# EAGLE schematic BluePLC B1 MEGA128 -00 (EAGLE 5.03)

## Sheet 1 of 4
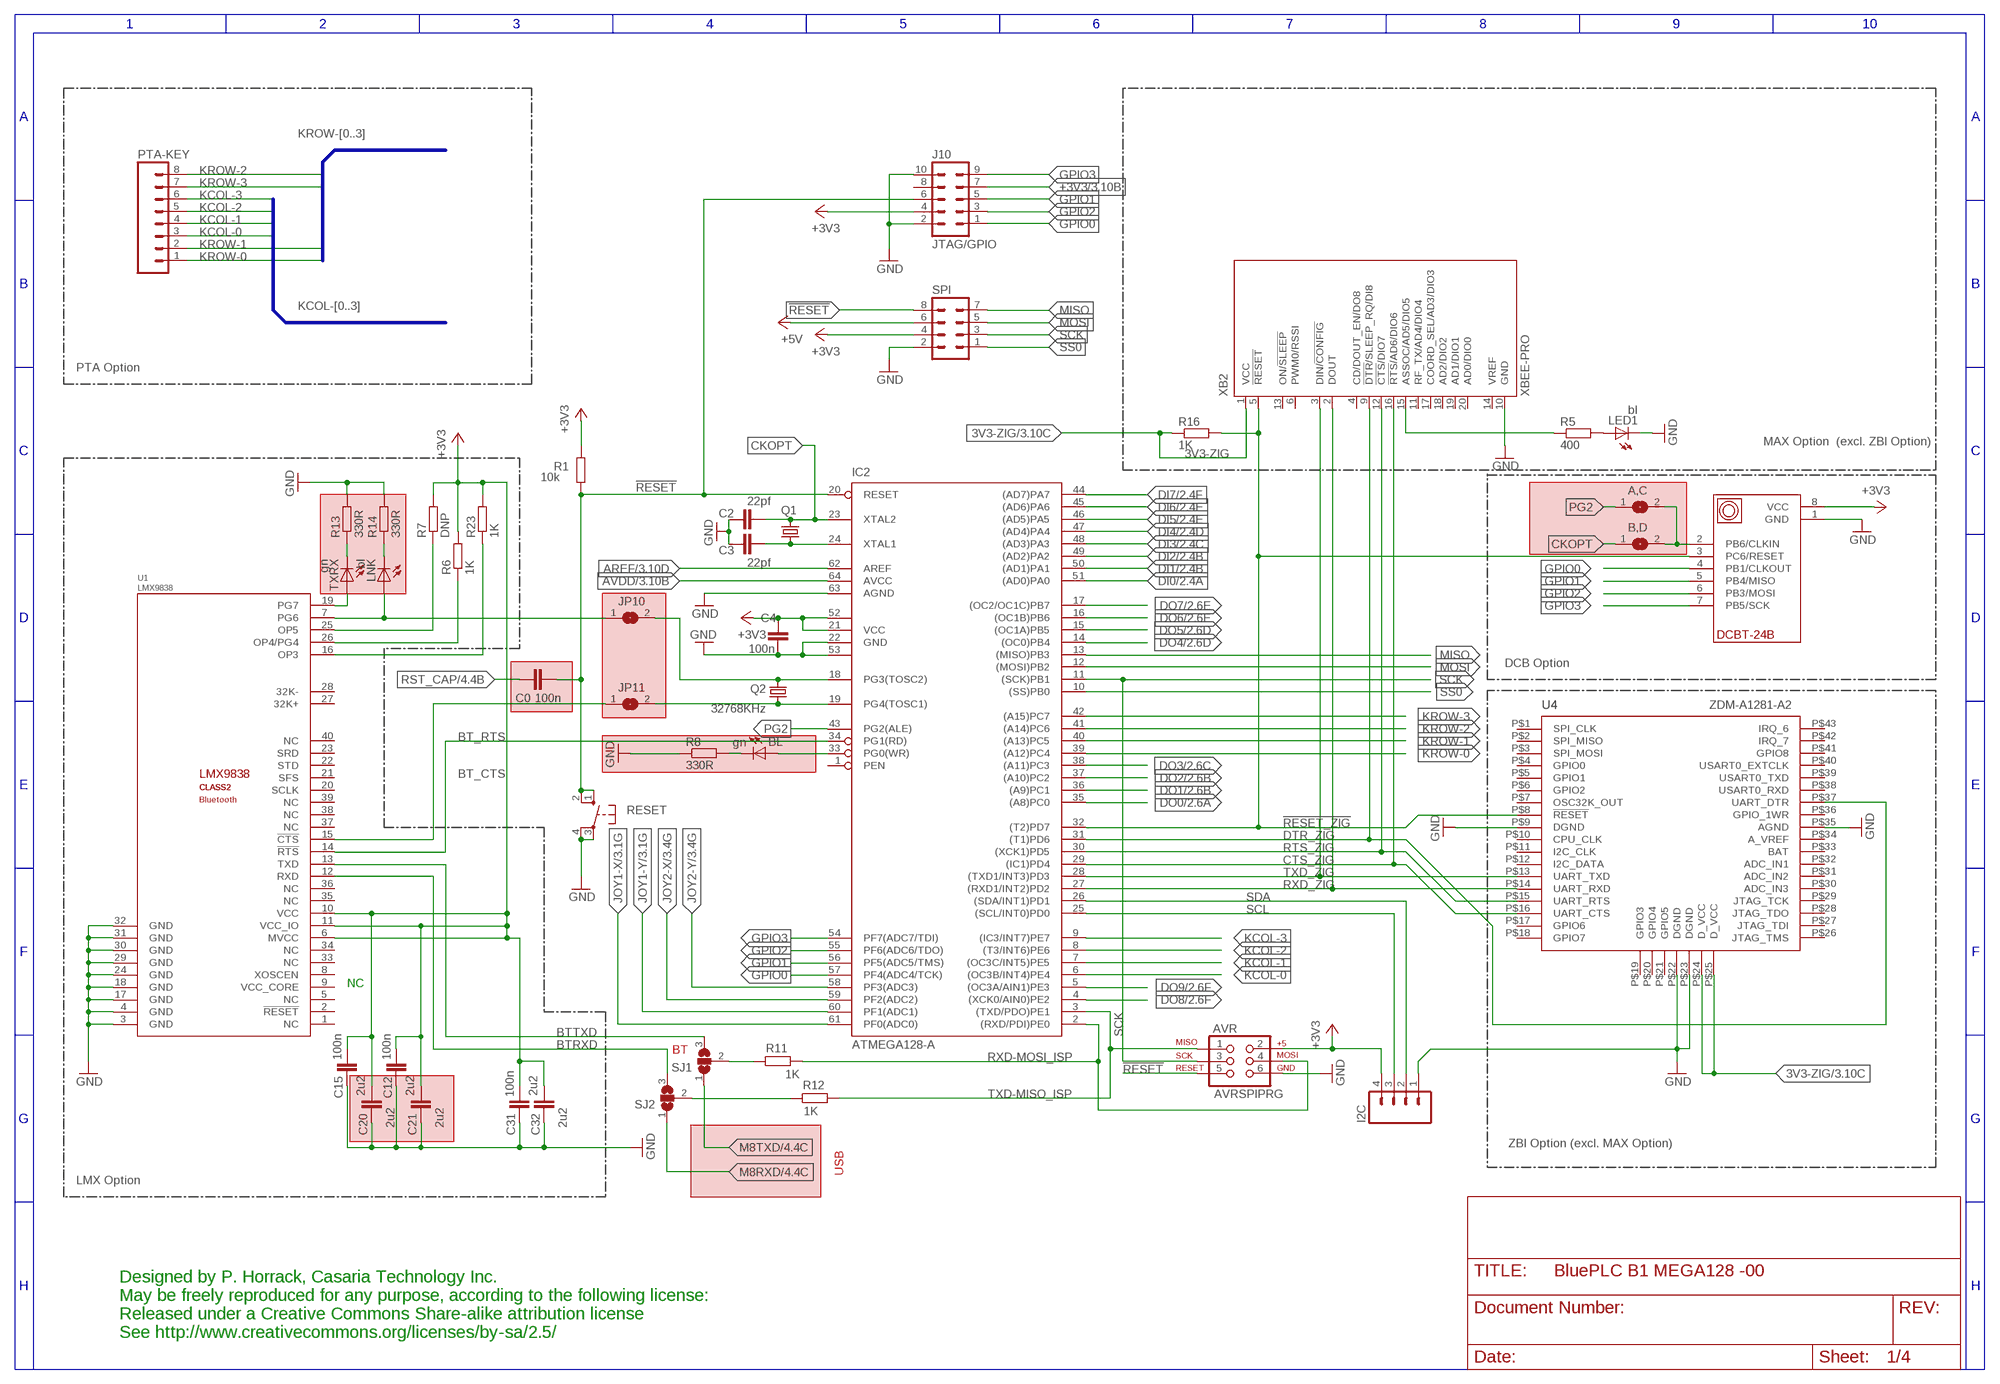
[diagram p0: schematic, sheet 1]

### Parts
A,C  SJ  [SJ]
AVR  AVRSPIPRG  AVR_SPI_PRG_6PTH  [2X3]
B,D  SJ  [SJ]
BL  gn  LEDCHIP-LED0603  [CHIP-LED0603]
C0  100n  C-EUC1206  [C1206]
C2  22pf  C-EUC0805  [C0805]
C3  22pf  C-EUC0805  [C0805]
C4  100n  C-EUC1206  [C1206]
C12  100n  C-EUC0805  [C0805]
C15  100n  C-EUC0805  [C0805]
C20  2u2  C-EUC0805  [C0805]
C21  2u2  C-EUC0805  [C0805]
C31  100n  C-EUC0805  [C0805]
C32  2u2  C-EUC1210  [C1210]
I2C  M04  [04P]
IC2  ATMEGA128-A  MEGA128-A  [TQFP64]
J10  JTAG/GPIO  MA05-2  [MA05-2]
JP10  SJ  [SJ]
JP11  SJ  [SJ]
LED1  bl  LEDCHIP-LED0603  [CHIP-LED0603]
LNK  bl  LEDCHIP-LED0603  [CHIP-LED0603]
PTA-KEY  M08  [08P]
Q1  16Mhz  CRYSTALHC49U-V  [HC49U-V]
Q2  32768KHz  CRYSTALTC38H  [TC38H]
R1  10k  R-EU_R1206  [R1206]
R5  400  R-EU_M0805  [M0805]
R6  1K  R-EU_R0805  [R0805]
R7  DNP  R-EU_R0805  [R0805]
R8  330R  R-EU_R0805  [R0805]
R11  1K  R-EU_R1206  [R1206]
R12  1K  R-EU_R1206  [R1206]
R13  330R  R-EU_R0805  [R0805]
R14  330R  R-EU_R0805  [R0805]
R16  1K  R-EU_R0805  [R0805]
R23  1K  R-EU_R0805  [R0805]
RESET  10-XX  [B3F-10XX]
SJ1  SJ2W  [SJ_2]
SJ2  SJ2W  [SJ_2]
SPI  MA04-2  [MA04-2]
TXRX  gn  LEDCHIP-LED0603  [CHIP-LED0603]
U1  LMX9838  [LMX9838]
U2  dcbt-24b  DCBT-24BDCBT-24ABCD-MILLMAX0295_SOCKET  [DCB-24B-MILLMAX0295]
U4  ZDM-A1281-A2  [ZDM-A2]
XB2  XBEE-PRO  [XBEE-PRO]

### Nets
3V3-ZIG: R16.1 U4.P$24(D_VCC) U4.P$25(D_VCC) XB2.1(VCC) ; also sheet 3
!RESET: AVR.5 C0.2 IC2.20(RESET) J10.6 R1.1 RESET.1(S) RESET.2(S1) SPI.8
!RESET_ZIG: IC2.32((T2)PD7) R16.2 U2.3(PC6/RESET) U4.P$8(!RESET) XB2.5(!RESET)
+3V3 [power]: AVR.2 C4.1 C12.1 C15.1 C20.1 C21.1 C31.1 C32.1 I2C.4 IC2.21(VCC) IC2.52(VCC1) J10.4 J10.7 R1.2 R6.2 R7.2 R23.2 SPI.4 U1.6(MVCC) U1.10(VCC) U1.11(VCC_IO) U2.8(VCC) ; also sheet 3,4
+5V [power]: SPI.6 ; also sheet 3
AREF [smps]: IC2.62(AREF) ; also sheet 3
AVDD: IC2.64(AVCC) ; also sheet 3
BT_CTS: JP11.1 U1.15(!CTS)
BT_RTS: IC2.34(PG1(RD)) U1.14(!RTS)
BTRXD [power]: SJ2.3 U1.12(RXD)
BTTXD [power]: SJ1.3 U1.13(TXD)
CKOPT: B,D.1 C2.2 IC2.23(XTAL2) Q1.2
CTS_ZIG: IC2.29((IC1)PD4) U4.P$16(UART_CTS) XB2.16(!RTS!/AD6/DIO6)
DI0: IC2.51((AD0)PA0) ; also sheet 2
DI1: IC2.50((AD1)PA1) ; also sheet 2
DI2: IC2.49((AD2)PA2) ; also sheet 2
DI3: IC2.48((AD3)PA3) ; also sheet 2
DI4: IC2.47((AD4)PA4) ; also sheet 2
DI5: IC2.46((AD5)PA5) ; also sheet 2
DI6: IC2.45((AD6)PA6) ; also sheet 2
DI7: IC2.44((AD7)PA7) ; also sheet 2
DO0: IC2.35((A8)PC0) ; also sheet 2
DO1: IC2.36((A9)PC1) ; also sheet 2
DO2: IC2.37((A10)PC2) ; also sheet 2
DO3: IC2.38((A11)PC3) ; also sheet 2
DO4: IC2.14((OC0)PB4) ; also sheet 2
DO5: IC2.15((OC1A)PB5) ; also sheet 2
DO6: IC2.16((OC1B)PB6) ; also sheet 2
DO7: IC2.17((OC2/OC1C)PB7) ; also sheet 2
DO8: IC2.4((XCK0/AIN0)PE2) ; also sheet 2
DO9: IC2.5((OC3A/AIN1)PE3) ; also sheet 2
DTR_ZIG: IC2.31((T1)PD6) U4.P$37(UART_DTR) XB2.9(!DTR!/SLEEP_RQ/DI8)
GND [gnd]: AVR.6 C2.1 C3.1 C4.2 C12.2 C15.2 C20.2 C21.2 C31.2 C32.2 I2C.1 IC2.22(GND) IC2.53(GND1) IC2.63(AGND) J10.2 J10.10 LED1.C R8.1 R13.2 R14.2 RESET.3(P) RESET.4(P1) SPI.2 U1.3(GND) U1.4(GND) U1.17(GND) U1.18(GND) U1.24(GND) U1.29(GND) U1.30(GND) U1.31(GND) U1.32(GND) U2.1(GND) U4.P$9(DGND) U4.P$22(DGND) U4.P$23(DGND) U4.P$35(AGND) XB2.10(GND) ; also sheet 2,3,4
GPIO0: IC2.57(PF4(ADC4/TCK)) J10.1 U2.4(PB1/CLKOUT)
GPIO1: IC2.56(PF5(ADC5/TMS)) J10.5 U2.5(PB4/MISO)
GPIO2: IC2.55(PF6(ADC6/TDO)) J10.3 U2.6(PB3/MOSI)
GPIO3: IC2.54(PF7(ADC7/TDI)) J10.9 U2.7(PB5/SCK)
JOY1-X: IC2.61(PF0(ADC0)) ; also sheet 3
JOY1-Y: IC2.60(PF1(ADC1)) ; also sheet 3
JOY2-X: IC2.59(PF2(ADC2)) ; also sheet 3
JOY2-Y: IC2.58(PF3(ADC3)) ; also sheet 3
KCOL-0: IC2.6((OC3B/INT4)PE4) PTA-KEY.3
KCOL-1: IC2.7((OC3C/INT5)PE5) PTA-KEY.4
KCOL-2: IC2.8((T3/INT6)PE6) PTA-KEY.5
KCOL-3: IC2.9((IC3/INT7)PE7) PTA-KEY.6
KROW-0: IC2.39((A12)PC4) PTA-KEY.1
KROW-1: IC2.40((A13)PC5) PTA-KEY.2
KROW-2: IC2.41((A14)PC6) PTA-KEY.8
KROW-3: IC2.42((A15)PC7) PTA-KEY.7
M8RXD: SJ2.1 ; also sheet 4
M8TXD: SJ1.1 ; also sheet 4
MISO: IC2.13((MISO)PB3) SPI.7
MOSI: IC2.12((MOSI)PB2) SPI.5
N$6: R11.1 SJ1.2
N$10: R13.1 TXRX.C
N$11: R6.1 U1.26(OP4/PG4)
N$23: LED1.A R5.2
N$24: R5.1 XB2.15(ASSOC/AD5/DIO5)
N$31: C3.2 IC2.24(XTAL1) Q1.1
N$37: R7.1 U1.25(OP5)
N$38: LNK.C R14.1
N$39: BL.C R8.2
N$61: BL.A IC2.33(PG0(WR))
N$64: TXRX.A U1.19(PG7)
N$66: A,C.2 B,D.2 U2.2(PB6/CLKIN)
N$67: R12.1 SJ2.2
N$74: R23.1 U1.16(OP3)
N$94: IC2.18(PG3(TOSC2)) JP10.2 Q2.2
N$95: IC2.19(PG4(TOSC1)) JP11.2 Q2.1
PG2: A,C.1 IC2.43(PG2(ALE))
RST_CAP: C0.1 ; also sheet 4
RTS_ZIG: IC2.30((XCK1)PD5) U4.P$15(UART_RTS) XB2.12(!CTS!/DIO7)
RXD-MOSI_ISP: AVR.4 IC2.2((RXD/PDI)PE0) R11.2
RXD_ZIG: IC2.27((RXD1/INT2)PD2) U4.P$14(UART_RXD) XB2.2(DOUT)
SCK: AVR.3 IC2.11((SCK)PB1) SPI.3
SCL: I2C.3 IC2.25((SCL/INT0)PD0)
SDA: I2C.2 IC2.26((SDA/INT1)PD1)
SS0: IC2.10((SS)PB0) SPI.1
TX/RX: JP10.1 LNK.A U1.7(PG6)
TXD-MISO_ISP: AVR.1 IC2.3((TXD/PDO)PE1) R12.2
TXD_ZIG: IC2.28((TXD1/INT3)PD3) U4.P$13(UART_TXD) XB2.3(DIN/!CONFIG)
Unconnected: IC2.1(PEN) J10.8 U1.1(NC) U1.2(!RESET) U1.5(NC) U1.8(XOSCEN) U1.20(SCLK) U1.21(SFS) U1.22(STD) U1.23(SRD) U1.27(32K+) U1.28(32K-) U1.33(NC) U1.34(NC) U1.35(NC) U1.36(NC) U1.37(NC) U1.38(NC) U1.39(NC) U1.40(NC) U4.P$1(SPI_CLK) U4.P$2(SPI_MISO) U4.P$3(SPI_MOSI) U4.P$4(GPIO0) U4.P$5(GPIO1) U4.P$6(GPIO2) U4.P$7(OSC32K_OUT) U4.P$10(CPU_CLK) U4.P$11(I2C_CLK) U4.P$12(I2C_DATA) U4.P$17(GPIO6) U4.P$18(GPIO7) U4.P$19(GPIO3) U4.P$20(GPIO4) U4.P$21(GPIO5) U4.P$26(JTAG_TMS) U4.P$27(JTAG_TDI) U4.P$28(JTAG_TDO) U4.P$29(JTAG_TCK) U4.P$30(ADC_IN3) U4.P$31(ADC_IN2) U4.P$32(ADC_IN1) U4.P$34(A_VREF) U4.P$36(GPIO_1WR) U4.P$38(USART0_RXD) U4.P$39(USART0_TXD) U4.P$40(USART0_EXTCLK) U4.P$41(GPIO8) U4.P$42(IRQ_7) U4.P$43(IRQ_6) XB2.4(CD/DOUT_EN/DO8) XB2.6(PWM0/RSSI) XB2.11(RF_TX/AD4/DIO4) XB2.13(ON/!SLEEP) XB2.14(VREF) XB2.17(COORD_SEL/AD3/DIO3) XB2.18(AD2/DIO2) XB2.19(AD1/DIO1) XB2.20(AD0/DIO0)

### Buses
KROW-[0..3]
KCOL-[0..3]

### Notes on the sheet
- PTA Option
- MAX Option  (excl. ZBI Option)
- DCB Option
- NC
- BT
- ZBI Option (excl. MAX Option)
- USB
- LMX Option
- Designed by P. Horrack, Casaria Technology Inc.
- May be freely reproduced for any purpose, according to the following license:
- Released under a Creative Commons Share-alike attribution license
- See http://www.creativecommons.org/licenses/by-sa/2.5/

## Sheet 2 of 4
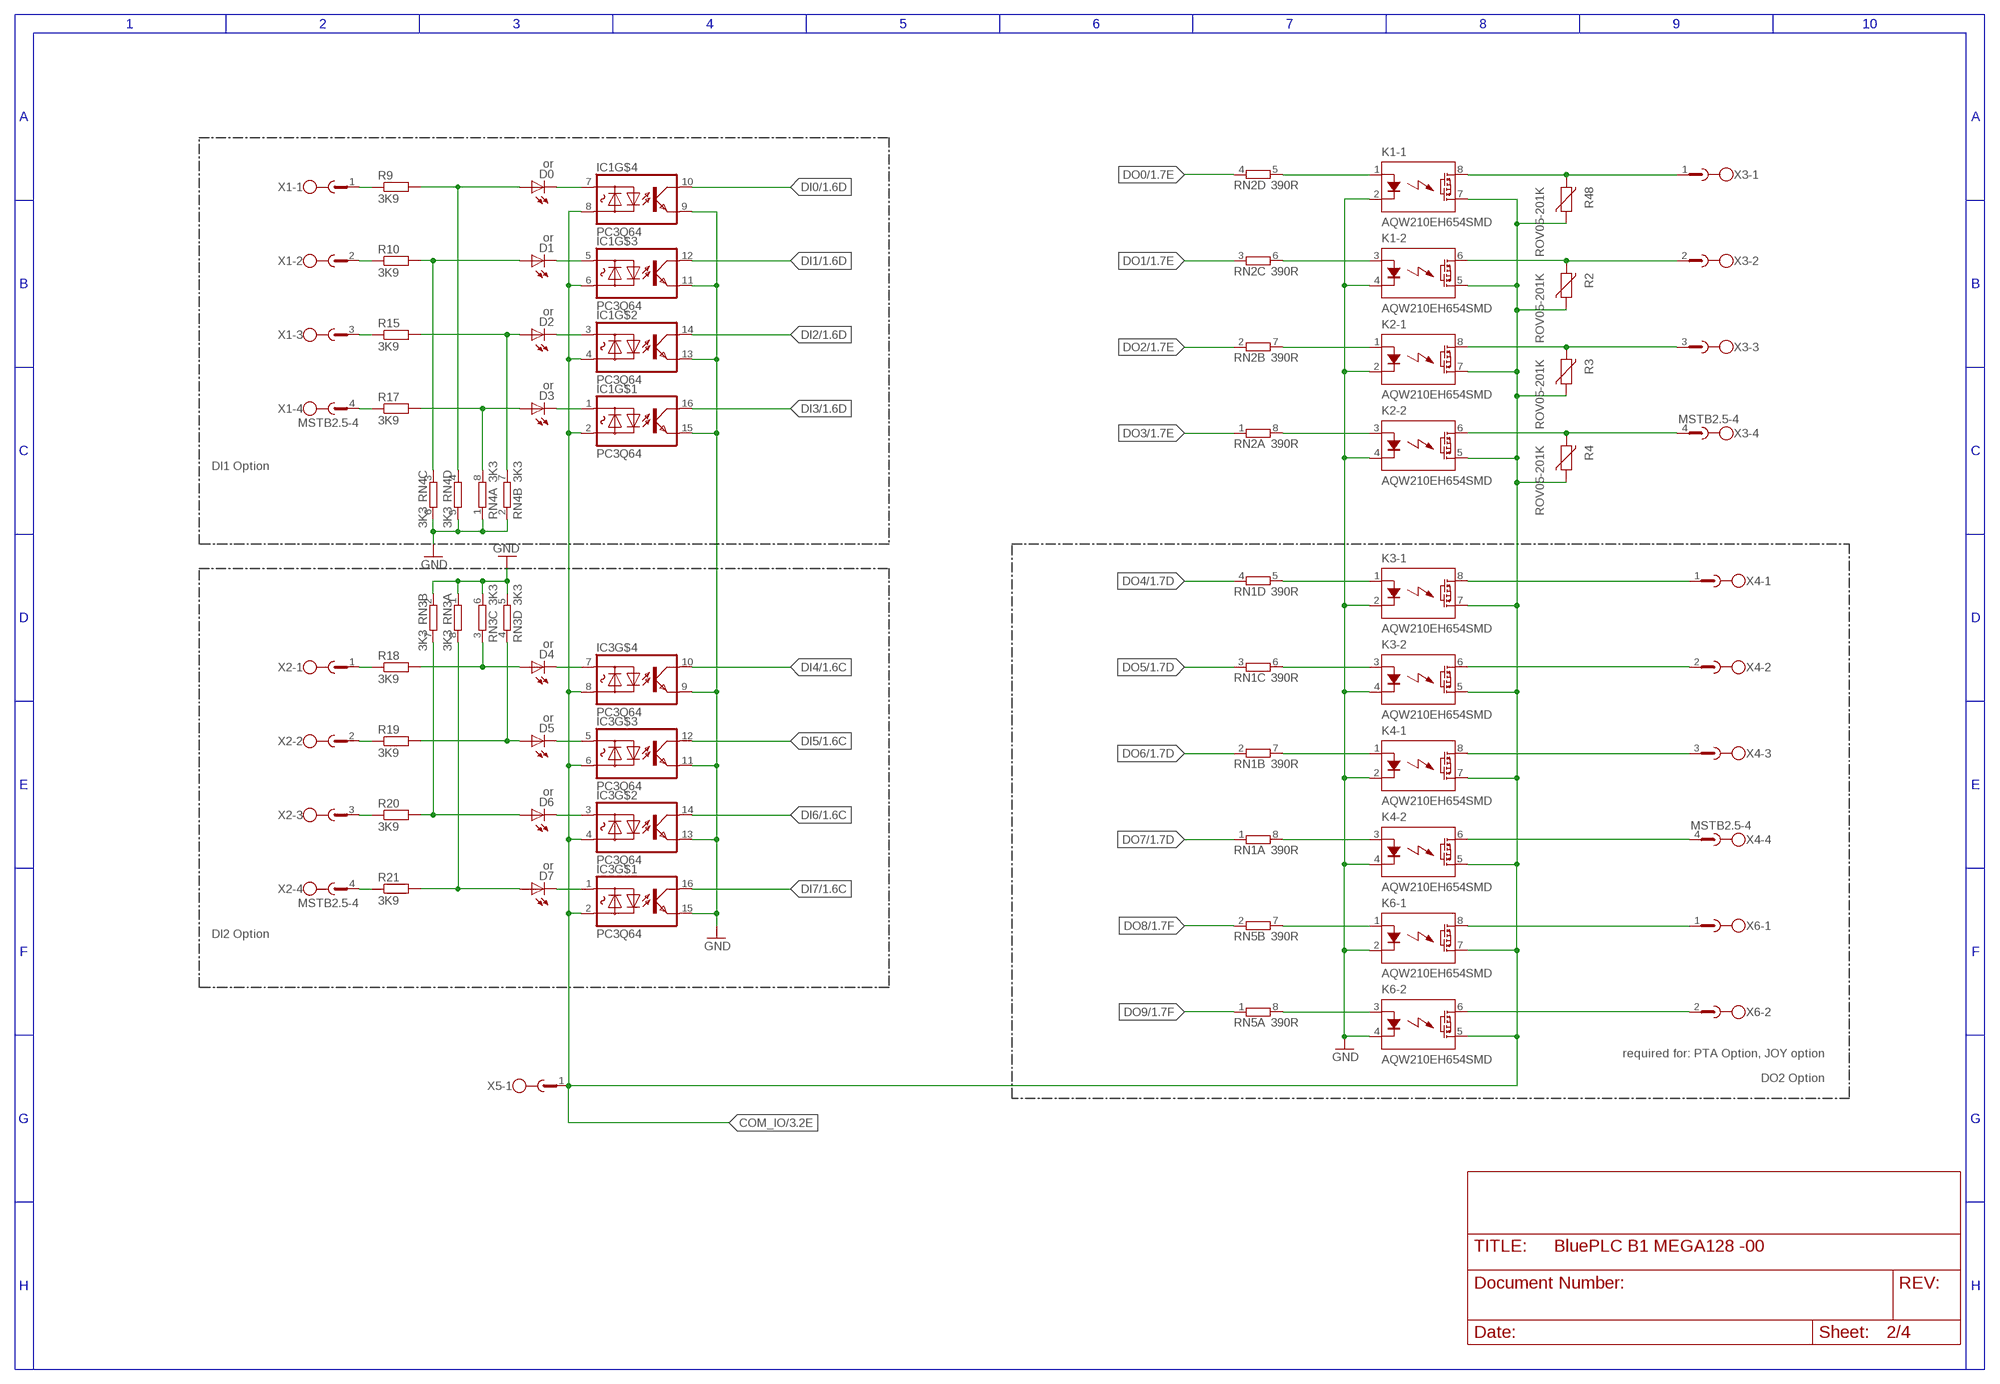
[diagram p1: schematic, sheet 2]

### Parts
D0  or  LEDCHIP-LED0603  [CHIP-LED0603]
D1  or  LEDCHIP-LED0603  [CHIP-LED0603]
D2  or  LEDCHIP-LED0603  [CHIP-LED0603]
D3  or  LEDCHIP-LED0603  [CHIP-LED0603]
D4  or  LEDCHIP-LED0603  [CHIP-LED0603]
D5  or  LEDCHIP-LED0603  [CHIP-LED0603]
D6  or  LEDCHIP-LED0603  [CHIP-LED0603]
D7  or  LEDCHIP-LED0603  [CHIP-LED0603]
IC1  PC3Q64  [SO16-OC]
IC3  PC3Q64  [SO16-OC]
K1  AQW210EH654SMD  [DIL08SMD]
K2  AQW210EH654SMD  [DIL08SMD]
K3  AQW210EH654SMD  [DIL08SMD]
K4  AQW210EH654SMD  [DIL08SMD]
K6  AQW210EH654SMD  [DIL08SMD]
R2  ROV05-201K  VARISTORS05K11  [S05K11]
R3  ROV05-201K  VARISTORS05K11  [S05K11]
R4  ROV05-201K  VARISTORS05K11  [S05K11]
R9  3K9  R-EU_R0805  [R0805]
R10  3K9  R-EU_R0805  [R0805]
R15  3K9  R-EU_R0805  [R0805]
R17  3K9  R-EU_R0805  [R0805]
R18  3K9  R-EU_R0805  [R0805]
R19  3K9  R-EU_R0805  [R0805]
R20  3K9  R-EU_R0805  [R0805]
R21  3K9  R-EU_R0805  [R0805]
R48  ROV05-201K  VARISTORS05K11  [S05K11]
RN1  390R  4R-NCAT16  [CAT16]
RN2  390R  4R-NCAT16  [CAT16]
RN3  3K3  4R-NCAT16  [CAT16]
RN4  3K3  4R-NCAT16  [CAT16]
RN5  390R  4R-NCAT16  [CAT16]
X1  MSTB2.5-4  [MSTB2.5-4]
X2  MSTB2.5-4  [MSTB2.5-4]
X3  MSTB2.5-4  [MSTB2.5-4]
X4  MSTB2.5-4  [MSTB2.5-4]
X5  MSTB2.5-5  [MSTB2.5-5]
X6  MSTB2.5-4  [MSTB2.5-4]

### Nets
COM_IO: IC1.2(C) IC1.4(C) IC1.6(C) IC1.8(C) IC3.2(C) IC3.4(C) IC3.6(C) IC3.8(C) K1.5(-2:D2) K1.7(-1:D2) K2.5(-2:D2) K2.7(-1:D2) K3.5(-2:D2) K3.7(-1:D2) K4.5(-2:D2) K4.7(-1:D2) K6.5(-2:D2) K6.7(-1:D2) R2.1 R3.1 R4.1 R48.1 X5.1 ; also sheet 3
DI0: IC1.10(COL) ; also sheet 1
DI1: IC1.12(COL) ; also sheet 1
DI2: IC1.14(COL) ; also sheet 1
DI3: IC1.16(COL) ; also sheet 1
DI4: IC3.10(COL) ; also sheet 1
DI5: IC3.12(COL) ; also sheet 1
DI6: IC3.14(COL) ; also sheet 1
DI7: IC3.16(COL) ; also sheet 1
DO0: RN2.4 ; also sheet 1
DO1: RN2.3 ; also sheet 1
DO2: RN2.2 ; also sheet 1
DO3: RN2.1 ; also sheet 1
DO4: RN1.4 ; also sheet 1
DO5: RN1.3 ; also sheet 1
DO6: RN1.2 ; also sheet 1
DO7: RN1.1 ; also sheet 1
DO8: RN5.2 ; also sheet 1
DO9: RN5.1 ; also sheet 1
GND [gnd]: IC1.9(EMIT) IC1.11(EMIT) IC1.13(EMIT) IC1.15(EMIT) IC3.9(EMIT) IC3.11(EMIT) IC3.13(EMIT) IC3.15(EMIT) K1.2(-1:K) K1.4(-2:K) K2.2(-1:K) K2.4(-2:K) K3.2(-1:K) K3.4(-2:K) K4.2(-1:K) K4.4(-2:K) K6.2(-1:K) K6.4(-2:K) RN3.1 RN3.2 RN3.5 RN3.6 RN4.1 RN4.2 RN4.5 RN4.6 ; also sheet 1,3,4
N$2: D0.A R9.2 RN4.4
N$3: D0.C IC1.7(A)
N$5: D1.A R10.2 RN4.3
N$9: K1.8(-1:D1) R48.2 X3.1
N$12: K1.6(-2:D1) R2.2 X3.2
N$14: K6.8(-1:D1) X6.1
N$16: K2.8(-1:D1) R3.2 X3.3
N$18: K2.6(-2:D1) R4.2 X3.4
N$19: K3.8(-1:D1) X4.1
N$21: K6.6(-2:D1) X6.2
N$27: K6.1(-1:A) RN5.7
N$28: K6.3(-2:A) RN5.8
N$29: D1.C IC1.5(A)
N$32: D2.A R15.2 RN4.7
N$34: D2.C IC1.3(A)
N$35: K3.6(-2:D1) X4.2
N$36: D3.A R17.2 RN4.8
N$40: K4.8(-1:D1) X4.3
N$41: D3.C IC1.1(A)
N$42: D4.A R18.2 RN3.3
N$43: D4.C IC3.7(A)
N$44: D5.A R19.2 RN3.4
N$45: K4.6(-2:D1) X4.4
N$46: D6.A R20.2 RN3.7
N$47: D5.C IC3.5(A)
N$48: D7.A R21.2 RN3.8
N$49: D6.C IC3.3(A)
N$50: R9.1 X1.1
N$51: R10.1 X1.2
N$52: R15.1 X1.3
N$53: R17.1 X1.4
N$54: R18.1 X2.1
N$55: R19.1 X2.2
N$56: R20.1 X2.3
N$57: R21.1 X2.4
N$58: D7.C IC3.1(A)
N$78: K3.1(-1:A) RN1.5
N$79: K3.3(-2:A) RN1.6
N$80: K4.1(-1:A) RN1.7
N$81: K4.3(-2:A) RN1.8
N$89: K2.3(-2:A) RN2.8
N$91: K2.1(-1:A) RN2.7
N$92: K1.3(-2:A) RN2.6
N$93: K1.1(-1:A) RN2.5
Unconnected: RN5.3 RN5.4 RN5.5 RN5.6

### Notes on the sheet
- DI1 Option
- DI2 Option
- required for: PTA Option, JOY option
- DO2 Option

## Sheet 3 of 4
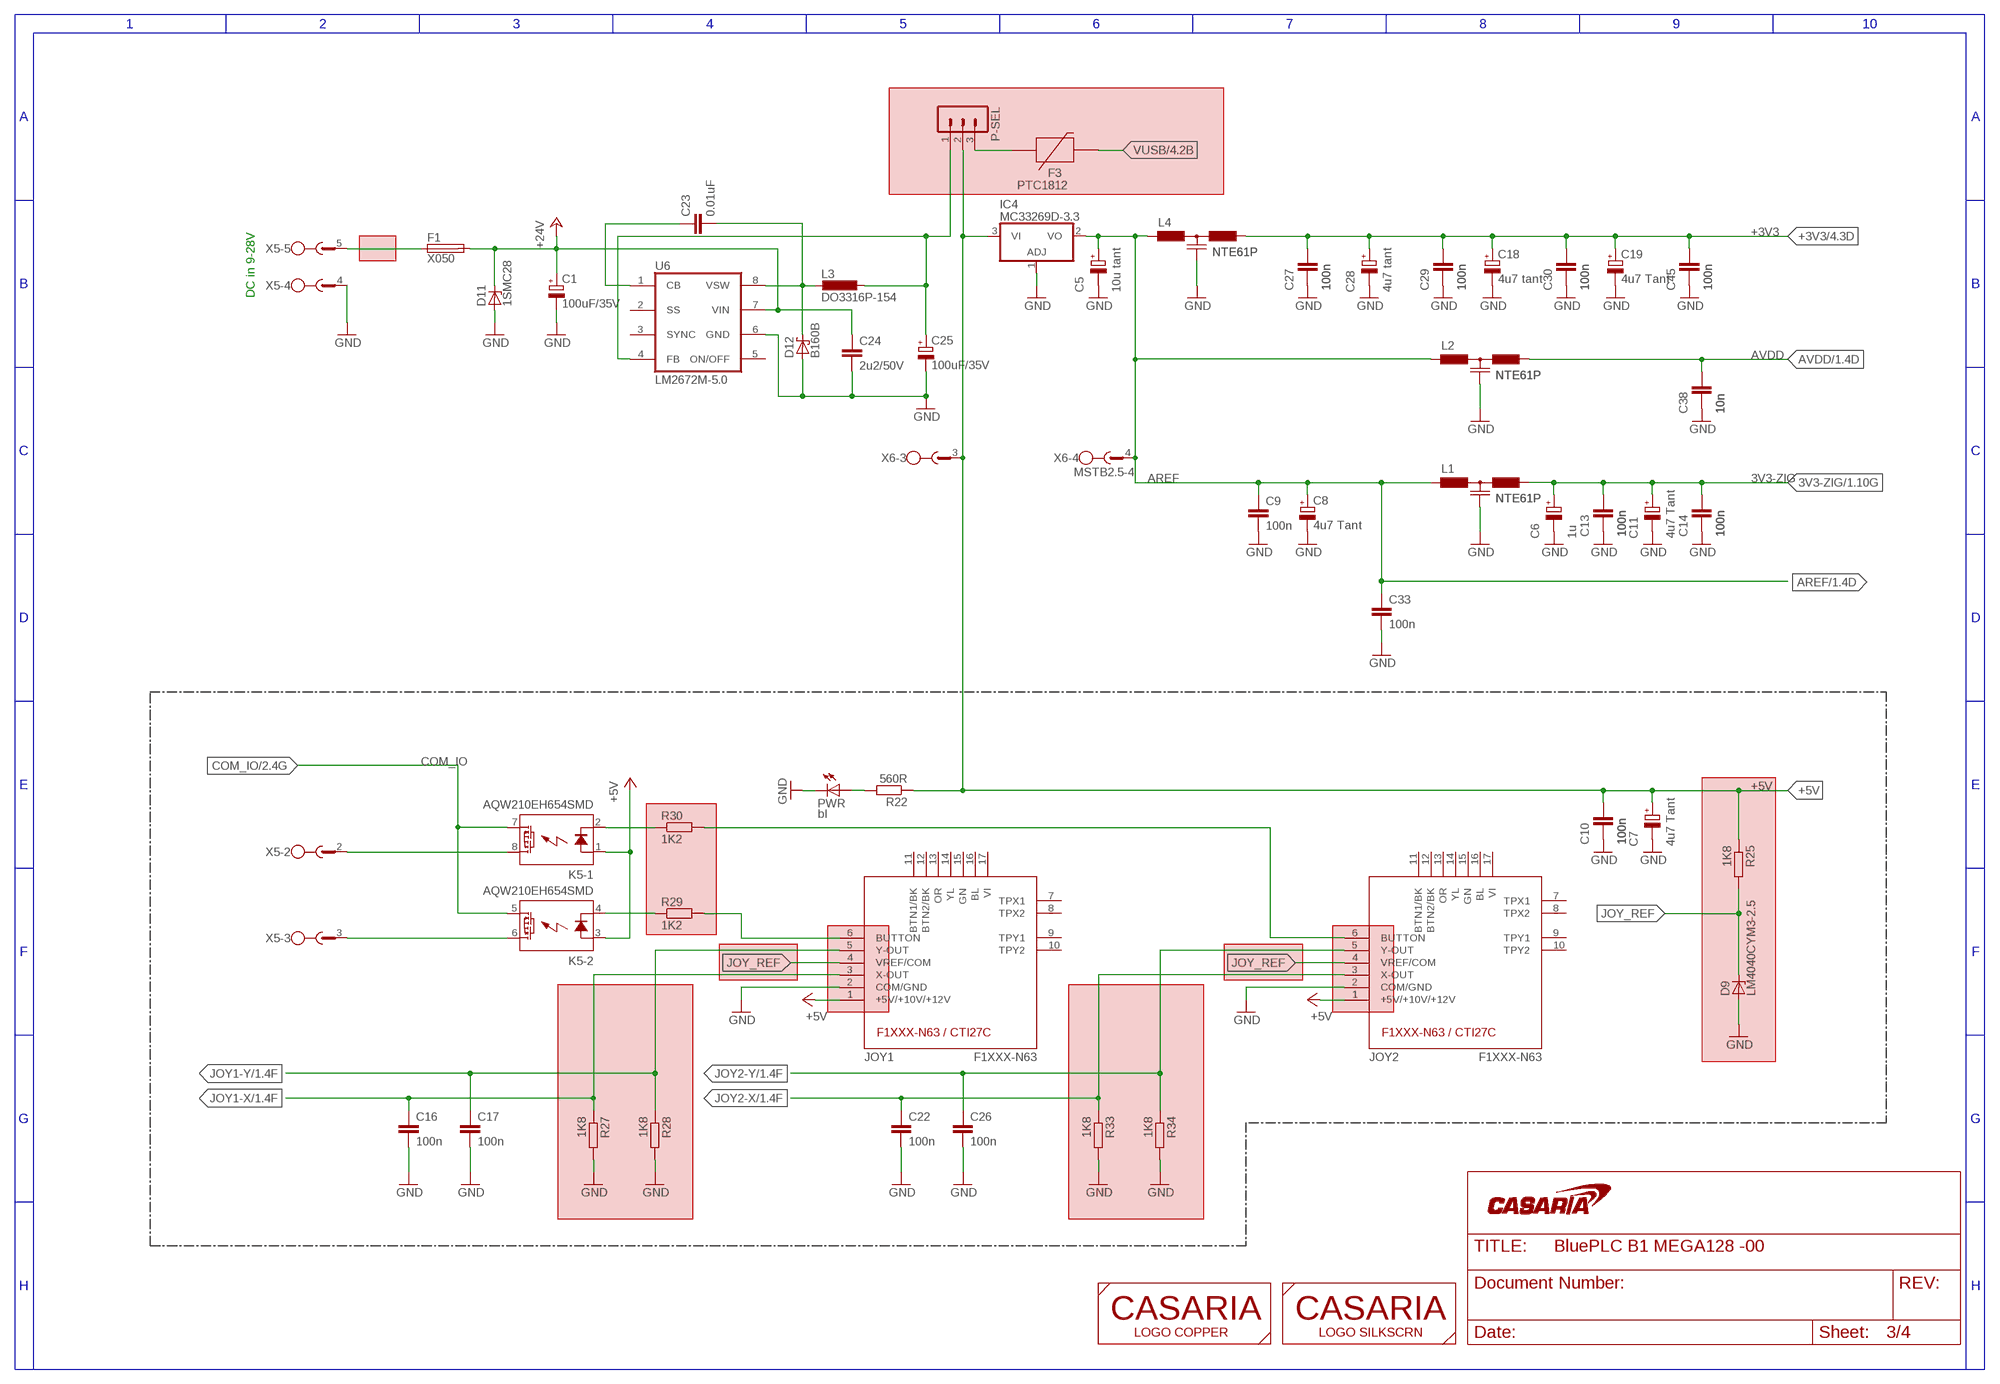
[diagram p2: schematic, sheet 3]

### Parts
C1  100uF/35V  CPOL-EU150CLZ-1010  [150CLZ-1010]
C5  10u tant  CPOL-EUSMCB  [SMC_B]
C6  1u  CPOL-EUSMCB  [SMC_B]
C7  4u7 Tant  CPOL-EUSMCB  [SMC_B]
C8  4u7 Tant  CPOL-EUSMCB  [SMC_B]
C9  100n  C-EUC1206  [C1206]
C10  100n  C-EUC1206  [C1206]
C11  4u7 Tant  CPOL-EUSMCB  [SMC_B]
C13  100n  C-EUC1206  [C1206]
C14  100n  C-EUC1206  [C1206]
C16  100n  C-EUC1206  [C1206]
C17  100n  C-EUC1206  [C1206]
C18  4u7 tant  CPOL-EUSMCB  [SMC_B]
C19  4u7 Tant  CPOL-EUSMCB  [SMC_B]
C22  100n  C-EUC1206  [C1206]
C23  0.01uF  C-EUC1206  [C1206]
C24  2u2/50V  C-EUC1812  [C1812]
C25  100uF/35V  CPOL-EU150CLZ-1010  [150CLZ-1010]
C26  100n  C-EUC1206  [C1206]
C27  100n  C-EUC1206  [C1206]
C28  4u7 tant  CPOL-EUSMCB  [SMC_B]
C29  100n  C-EUC1206  [C1206]
C30  100n  C-EUC1206  [C1206]
C33  100n  C-EUC1206  [C1206]
C38  10n  C-EUC0805  [C0805]
C45  100n  C-EUC1206  [C1206]
D9  LM4040CYM3-2.5  ZENER-DIODESOT23  [SOT23]
D11  1SMC28  [SMC]
D12  B160B  P4KEXX  [SMB]
F1  X050  POLYSWITCHFUSE  [SMC]
F3  PTC1812  [C1812]
IC4  MC33269D-3.3  [DPACK]
JOY1  F1XXX-N63  [CTI_JOY]
JOY2  F1XXX-N63  [CTI_JOY]
K5  AQW210EH654SMD  [DIL08SMD]
L1  NTE61P  NFE61P  [NFE61P]
L2  NTE61P  NFE61P  [NFE61P]
L3  DO3316P-154  DO3316P  [DO3316P]
L4  NTE61P  NFE61P  [NFE61P]
P-SEL  MA03-1  [MA03-1]
PWR  bl  LEDCHIP-LED0603  [CHIP-LED0603]
R22  560R  R-EU_R0805  [R0805]
R25  1K8  R-EU_R0805  [R0805]
R27  1K8  R-EU_R0805  [R0805]
R28  1K8  R-EU_R0805  [R0805]
R29  1K2  R-EU_R0805  [R0805]
R30  1K2  R-EU_R0805  [R0805]
R33  1K8  R-EU_R0805  [R0805]
R34  1K8  R-EU_R0805  [R0805]
U6  LM2672M-5.0  LM2672  [SO8]
U$9  CASARIA_LOGO_COPPER  [CASARIA_LOGO_COPPER]
U$10  CASARIA_LOGO_TPLACE  [CASARIA_LOGO]

### Nets
3V3-ZIG: C6.+ C11.+ C13.1 C14.1 L1.3 ; also sheet 1
5VREG [power]: C25.+ L3.2 P-SEL.1 U6.4(FB)
+3V3 [power]: C18.+ C19.+ C27.1 C28.+ C29.1 C30.1 C45.1 L4.3 ; also sheet 1,4
+5V [power]: C7.+ C10.1 IC4.3(VI) JOY1.1(+5V/+10V/+12V) JOY2.1(+5V/+10V/+12V) K5.1(-1:A) K5.3(-2:A) P-SEL.2 R22.1 R25.1 X6.3 ; also sheet 1
+24V [power]: C1.+ C24.1 D11.C F1.C U6.7(VIN)
AREF [smps]: C5.+ C8.+ C9.1 C33.1 IC4.2(VO) L1.1 L2.1 L4.1 X6.4 ; also sheet 1
AVDD: C38.1 L2.3 ; also sheet 1
COM_IO: K5.5(-2:D2) K5.7(-1:D2) ; also sheet 2
GND [gnd]: C1.- C5.- C6.- C7.- C8.- C9.2 C10.2 C11.- C13.2 C14.2 C16.2 C17.2 C18.- C19.- C22.2 C24.2 C25.- C26.2 C27.2 C28.- C29.2 C30.2 C33.2 C38.2 C45.2 D9.1(A) D11.A D12.A IC4.1(ADJ) JOY1.2(COM/GND) JOY2.2(COM/GND) L1.2 L2.2 L4.2 PWR.C R27.2 R28.2 R33.2 R34.2 U6.6(GND) X5.4 ; also sheet 1,2,4
JOY1-X: C16.1 JOY1.3(X-OUT) R27.1 ; also sheet 1
JOY1-Y: C17.1 JOY1.5(Y-OUT) R28.1 ; also sheet 1
JOY2-X: C22.1 JOY2.3(X-OUT) R33.1 ; also sheet 1
JOY2-Y: C26.1 JOY2.5(Y-OUT) R34.1 ; also sheet 1
JOY_REF: D9.3(C) JOY1.4(VREF/COM) JOY2.4(VREF/COM) R25.2
N$13: F3.1 P-SEL.3
N$17 [power]: F1.A X5.5
N$22: PWR.A R22.2
N$83: K5.2(-1:K) R30.1
N$84: JOY2.6(BUTTON) R30.2
N$85: K5.8(-1:D1) X5.2
N$86: K5.4(-2:K) R29.1
N$87: JOY1.6(BUTTON) R29.2
N$88: K5.6(-2:D1) X5.3
N$115: C23.1 U6.1(CB)
N$116 [smps]: C23.2 D12.C L3.1 U6.8(VSW)
VUSB [power]: F3.2 ; also sheet 4
Unconnected: JOY1.7(TPX1) JOY1.8(TPX2) JOY1.9(TPY1) JOY1.10(TPY2) JOY1.11(BTN1/BK) JOY1.12(BTN2/BK) JOY1.13(OR) JOY1.14(YL) JOY1.15(GN) JOY1.16(BL) JOY1.17(VI) JOY2.7(TPX1) JOY2.8(TPX2) JOY2.9(TPY1) JOY2.10(TPY2) JOY2.11(BTN1/BK) JOY2.12(BTN2/BK) JOY2.13(OR) JOY2.14(YL) JOY2.15(GN) JOY2.16(BL) JOY2.17(VI) U6.2(SS) U6.3(SYNC) U6.5(ON/OFF)

### Notes on the sheet
- DC in 9-28V

## Sheet 4 of 4
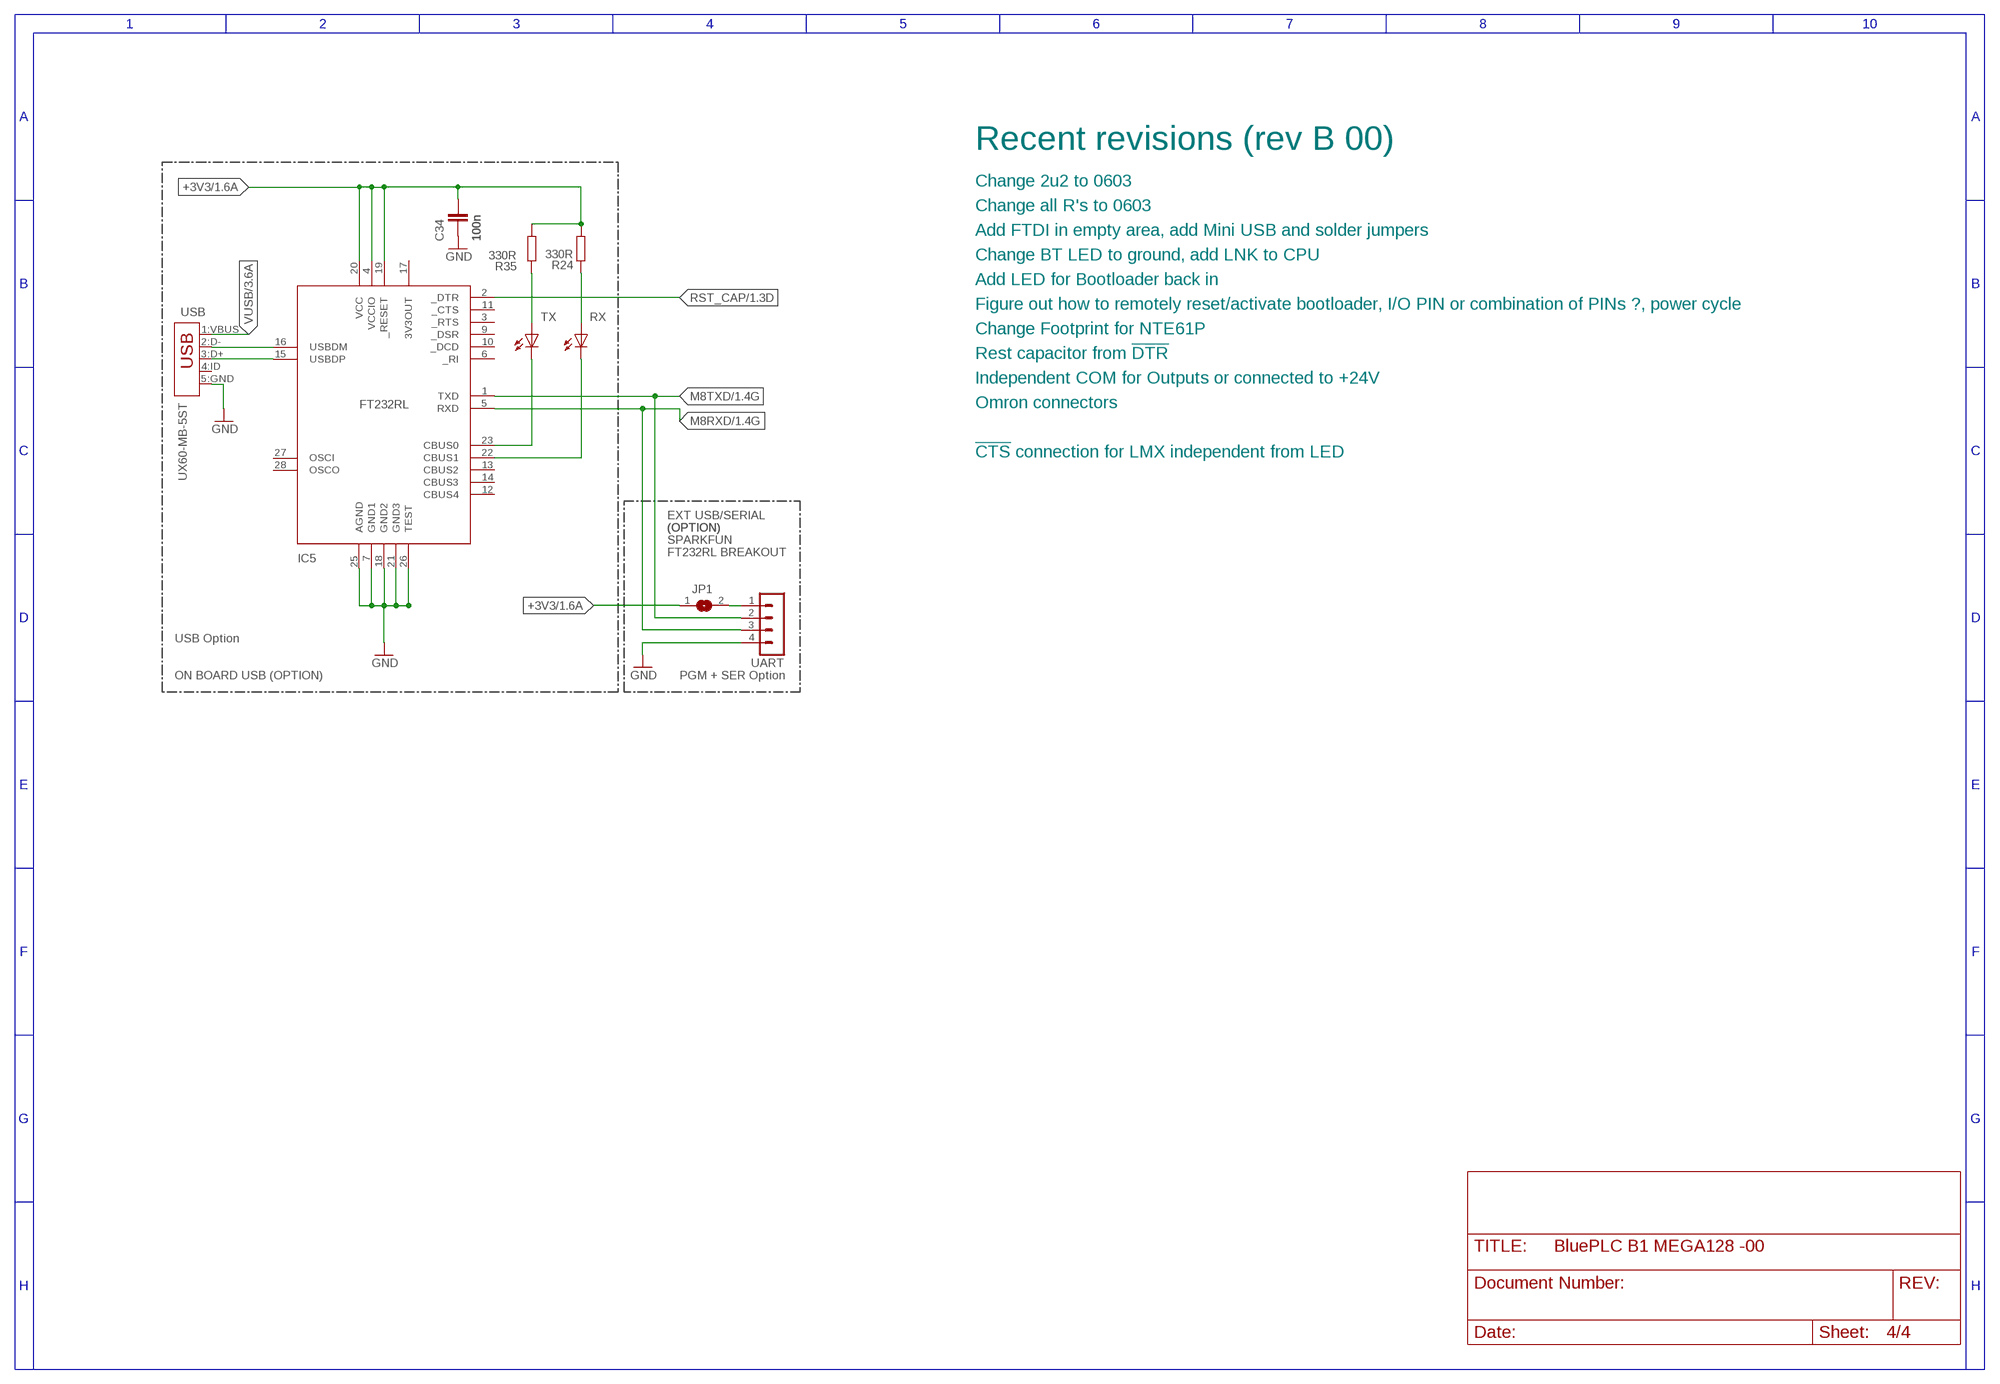
[diagram p3: schematic, sheet 4]

### Parts
C34  100n  C-EUC1206  [C1206]
IC5  FT232RL  FT232RL-PINNED  [SSOP28DB]
JP1  SJ  [SJ]
R24  330R  R-EU_R0805  [R0805]
R35  330R  R-EU_R0805  [R0805]
RX  LEDCHIP-LED0603  [CHIP-LED0603]
TX  LEDCHIP-LED0603  [CHIP-LED0603]
UART  MA04-1W  [MA04-1W]
USB  UX60-MB-5ST  MINIUSB  [UX60A-MB-5SY]

### Nets
+3V3 [power]: C34.1 IC5.4(VCCIO) IC5.19(_RESET) IC5.20(VCC) JP1.1 R24.1 R35.1 ; also sheet 1,3
GND [gnd]: C34.2 IC5.7(GND1) IC5.18(GND2) IC5.21(GND3) IC5.25(AGND) IC5.26(TEST) UART.4 USB.5:GND ; also sheet 1,2,3
M8RXD: IC5.5(RXD) UART.3 ; also sheet 1
M8TXD: IC5.1(TXD) UART.2 ; also sheet 1
N$7: JP1.2 UART.1
N$8: R35.2 TX.A
N$15: IC5.16(USBDM) USB.2:D-
N$26: IC5.15(USBDP) USB.3:D+
N$59: IC5.23(CBUS0) TX.C
N$63: IC5.22(CBUS1) RX.C
N$65: R24.2 RX.A
RST_CAP: IC5.2(_DTR) ; also sheet 1
VUSB [power]: USB.1:VBUS ; also sheet 3
Unconnected: IC5.3(_RTS) IC5.6(_RI) IC5.9(_DSR) IC5.10(_DCD) IC5.11(_CTS) IC5.12(CBUS4) IC5.13(CBUS2) IC5.14(CBUS3) IC5.17(3V3OUT) IC5.27(OSCI) IC5.28(OSCO) USB.4:ID

### Notes on the sheet
- Recent revisions (rev B 00)
- Change 2u2 to 0603
- Change all R's to 0603
- Add FTDI in empty area, add Mini USB and solder jumpers
- Change BT LED to ground, add LNK to CPU
- Add LED for Bootloader back in
- Figure out how to remotely reset/activate bootloader, I/O PIN or combination of PINs ?, power cycle
- Change Footprint for NTE61P
- Rest capacitor from !DTR
- Independent COM for Outputs or connected to +24V
- FT232RL | Omron connectors
- !CTS! connection for LMX independent from LED
- EXT USB/SERIAL
- (OPTION) | (OPTION)
- SPARKFUN
- FT232RL BREAKOUT
- USB Option
- ON BOARD USB (OPTION) | PGM + SER Option

## Power pins joined to a net without a drawn wire
BAT: U4.P$33(BAT)
VCC_CORE: U1.9(VCC_CORE)

## Library data of the parts
A,C B,D JP1 JP10 JP11 = jumper:SJ: SMD solder JUMPER
AVR = SparkFun:AVR_SPI_PRG_6: AVR ISP 6 Pin This is the reduced ISP connector for AVR programming. Common on Arduino. This footprint will take up less PCB space and can be used with a 10-pin to 6-pin adapter such as SKU: BOB-08508
BL D0 D1-D7 LED1 LNK PWR RX TX TXRX = led:LED: LED OSRAM: - CHIPLED LG R971, LG N971, LY N971, LG Q971, LY Q971, LO R971, LY R971 LH N974, LH R974 LS Q976, LO Q976, LY Q976 LO Q996 - Hyper CHIPLED LW Q18S LB Q993, LB Q99A, LB R99A - SideLED LS A670, LO A670, LY A670, LG A670, LP A670 LB A673, LV A673, LT A673, LW A673 LH A674 LY A675 LS A676, LA A676, LO A676, LY A676, LW A676 LS A679, LY A679, LG A679 - Hyper Micro SIDELED® LS Y876, LA Y876, LO Y876, LY Y876 LT Y87S - SmartLED LW L88C, LW L88S LB L89C, LB L89S, LG L890 LS L89K, LO L89K, LY L89K LS L896, LA L896, LO L896, LY L896 - TOPLED LS T670, LO T670, LY T670, LG T670, LP T670 LSG T670, LSP T670, LSY T670, LOP T670, LYG T670 LG T671, LOG T671, LSG T671 LB T673, LV T673, LT T673, LW T673 LH T674 LS T676, LA T676, LO T676, LY T676, LB T676, LH T676, LSB T676, LW T676 LB T67C, LV T67C, LT T67C, LS T67K, LO T67K, LY T67K, LW E67C LS E67B, LA E67B, LO E67B, LY E67B, LB E67C, LV E67C, LT E67C LW T67C LS T679, LY T679, LG T679 LS T770, LO T770, LY T770, LG T770, LP T770 LB T773, LV T773, LT T773, LW T773 LH T774 LS E675, LA E675, LY E675, LS T675 LS T776, LA T776, LO T776, LY T776, LB T776 LHGB T686 LT T68C, LB T68C - Hyper Mini TOPLED® LB M676 - Mini TOPLED Santana® LG M470 LS M47K, LO M47K, LY M47K Source: http://www.osram.convergy.de/
C0 C2-C4 C9 C10 C12-C17 C20-C24 C26 C27 C29-C34 C38 C45 = rcl:C-EU: CAPACITOR, European symbol
C1 C5-C8 C11 C18 C19 C25 C28 = rcl:CPOL-EU: POLARIZED CAPACITOR, European symbol
D9 = diode:ZENER-DIODE: Z-Diode
D11 = CASARIA:1SMC: Transient Supression Zener Diode 1500 W, 5.0-78 volts
D12 = CASARIA:P4KEXX
F1 = CASARIA:POLYSWITCHFUSE
F3 = SparkFunEagle-6-6-07:PTC: Resettable Fuse PTC Resettable Fuse. Spark Fun Electronics SKU : COM-08357
I2C = con-amp-quick:M04: AMP QUICK CONNECTOR
IC1 IC3 = CASARIA:PC3Q64: TEXAS INSTRUMENTS OPTO COUPLER
IC2 = atmel:MEGA128: MICROCONTROLLER 128 Kbytes FLASH 4 Kbytes SRAM 4 Kbytes EEPROM DUAL USART 8-channel 10 bit ADC Source: avr.lbr
IC4 = CASARIA:MC33269?*: Adjustable Output Low Dropout Voltage Regulator 800 mA Source: http://www.onsemi.com/pub/Collateral/MC33269-D.PDF
IC5 = my-library:FT232RL-PINNED: USB UART FT232RL 4th Generation USB UART (USB <-> Serial) Controller. Spark Fun Electronics SKU : COM-00650
J10 = con-lstb:MA05-2: PIN HEADER
JOY1 JOY2 = CTI_JOYSTICK:F1XXX-N63
K1-K6 = CASARIA:AQW210EH: PhotoMOS Relay NAiS Source: http://www.mew-europe.com/.. pti_en.pdf
L1 L2 L4 = CASARIA:NFE61P
L3 = inductor-coilcraft:DO3316P: COILCRAFT
P-SEL = con-lstb:MA03-1: PIN HEADER
PTA-KEY = con-amp-quick:M08: AMP QUICK CONNECTOR
Q1 Q2 = crystal:CRYSTAL: CRYSTAL
R1 R5-R25 R27-R30 R33-R35 = rcl:R-EU_: RESISTOR, European symbol
R2-R4 R48 = varistor:VARISTOR: VARISTOR
RESET = switch-omron:10-XX: OMRON SWITCH
RN1-RN5 = resistor-dil:4R-N: Array Chip Resistor Source: RS Component / Phycomp
SJ1 SJ2 = jumper:SJ2W: SMD solder JUMPER
SPI = con-lstb:MA04-2: PIN HEADER
U1 = CASARIA_BLUETOOTH:LMX9838
U2 = Casaria_decibit:DCBT-24B: Nordic + Atmega168 2.4Ghz RF module
U4 = Casariamesh:ZDM-A1281-A2
U6 = LODIGE:LM2672
U$9 = CASARIA:CASARIA_LOGO_COPPER
U$10 = CASARIA:CASARIA_LOGO_TPLACE
UART = CASARIA:MA04-1W: PIN HEADER
USB = mini-usb:MINIUSB
X1-X4 X6 = con-phoenix-500:MSTB2.5-4
X5 = con-phoenix-500:MSTB2.5-5
XB2 = maxstream:XBEE: XBee (TM) /XBee-PRO(TM) OEM RF Modules Source: MaxStream, Inc. xbee_productmanual.pdf

## Net classes
0 default: width 0.203 mm, clearance 0.152 mm
1 smps: width 0.305 mm, drill 0.635 mm, clearance 0.152 mm
2 power: width 0.457 mm, drill 0.635 mm, clearance 0.152 mm
3 gnd: width 0.457 mm, drill 0.635 mm, clearance 0.152 mm